# EasyEDA Pro project SW3526 快充.epro

# Schematic Schematic1
Create Date: 2023-02-26; Page Name: P1; Project Name: SW3526 快充; Schematic Name: Schematic1; Update Date: 2023-02-28; Company: 嘉立创EDA; Page Size: A4; Version: V1.0
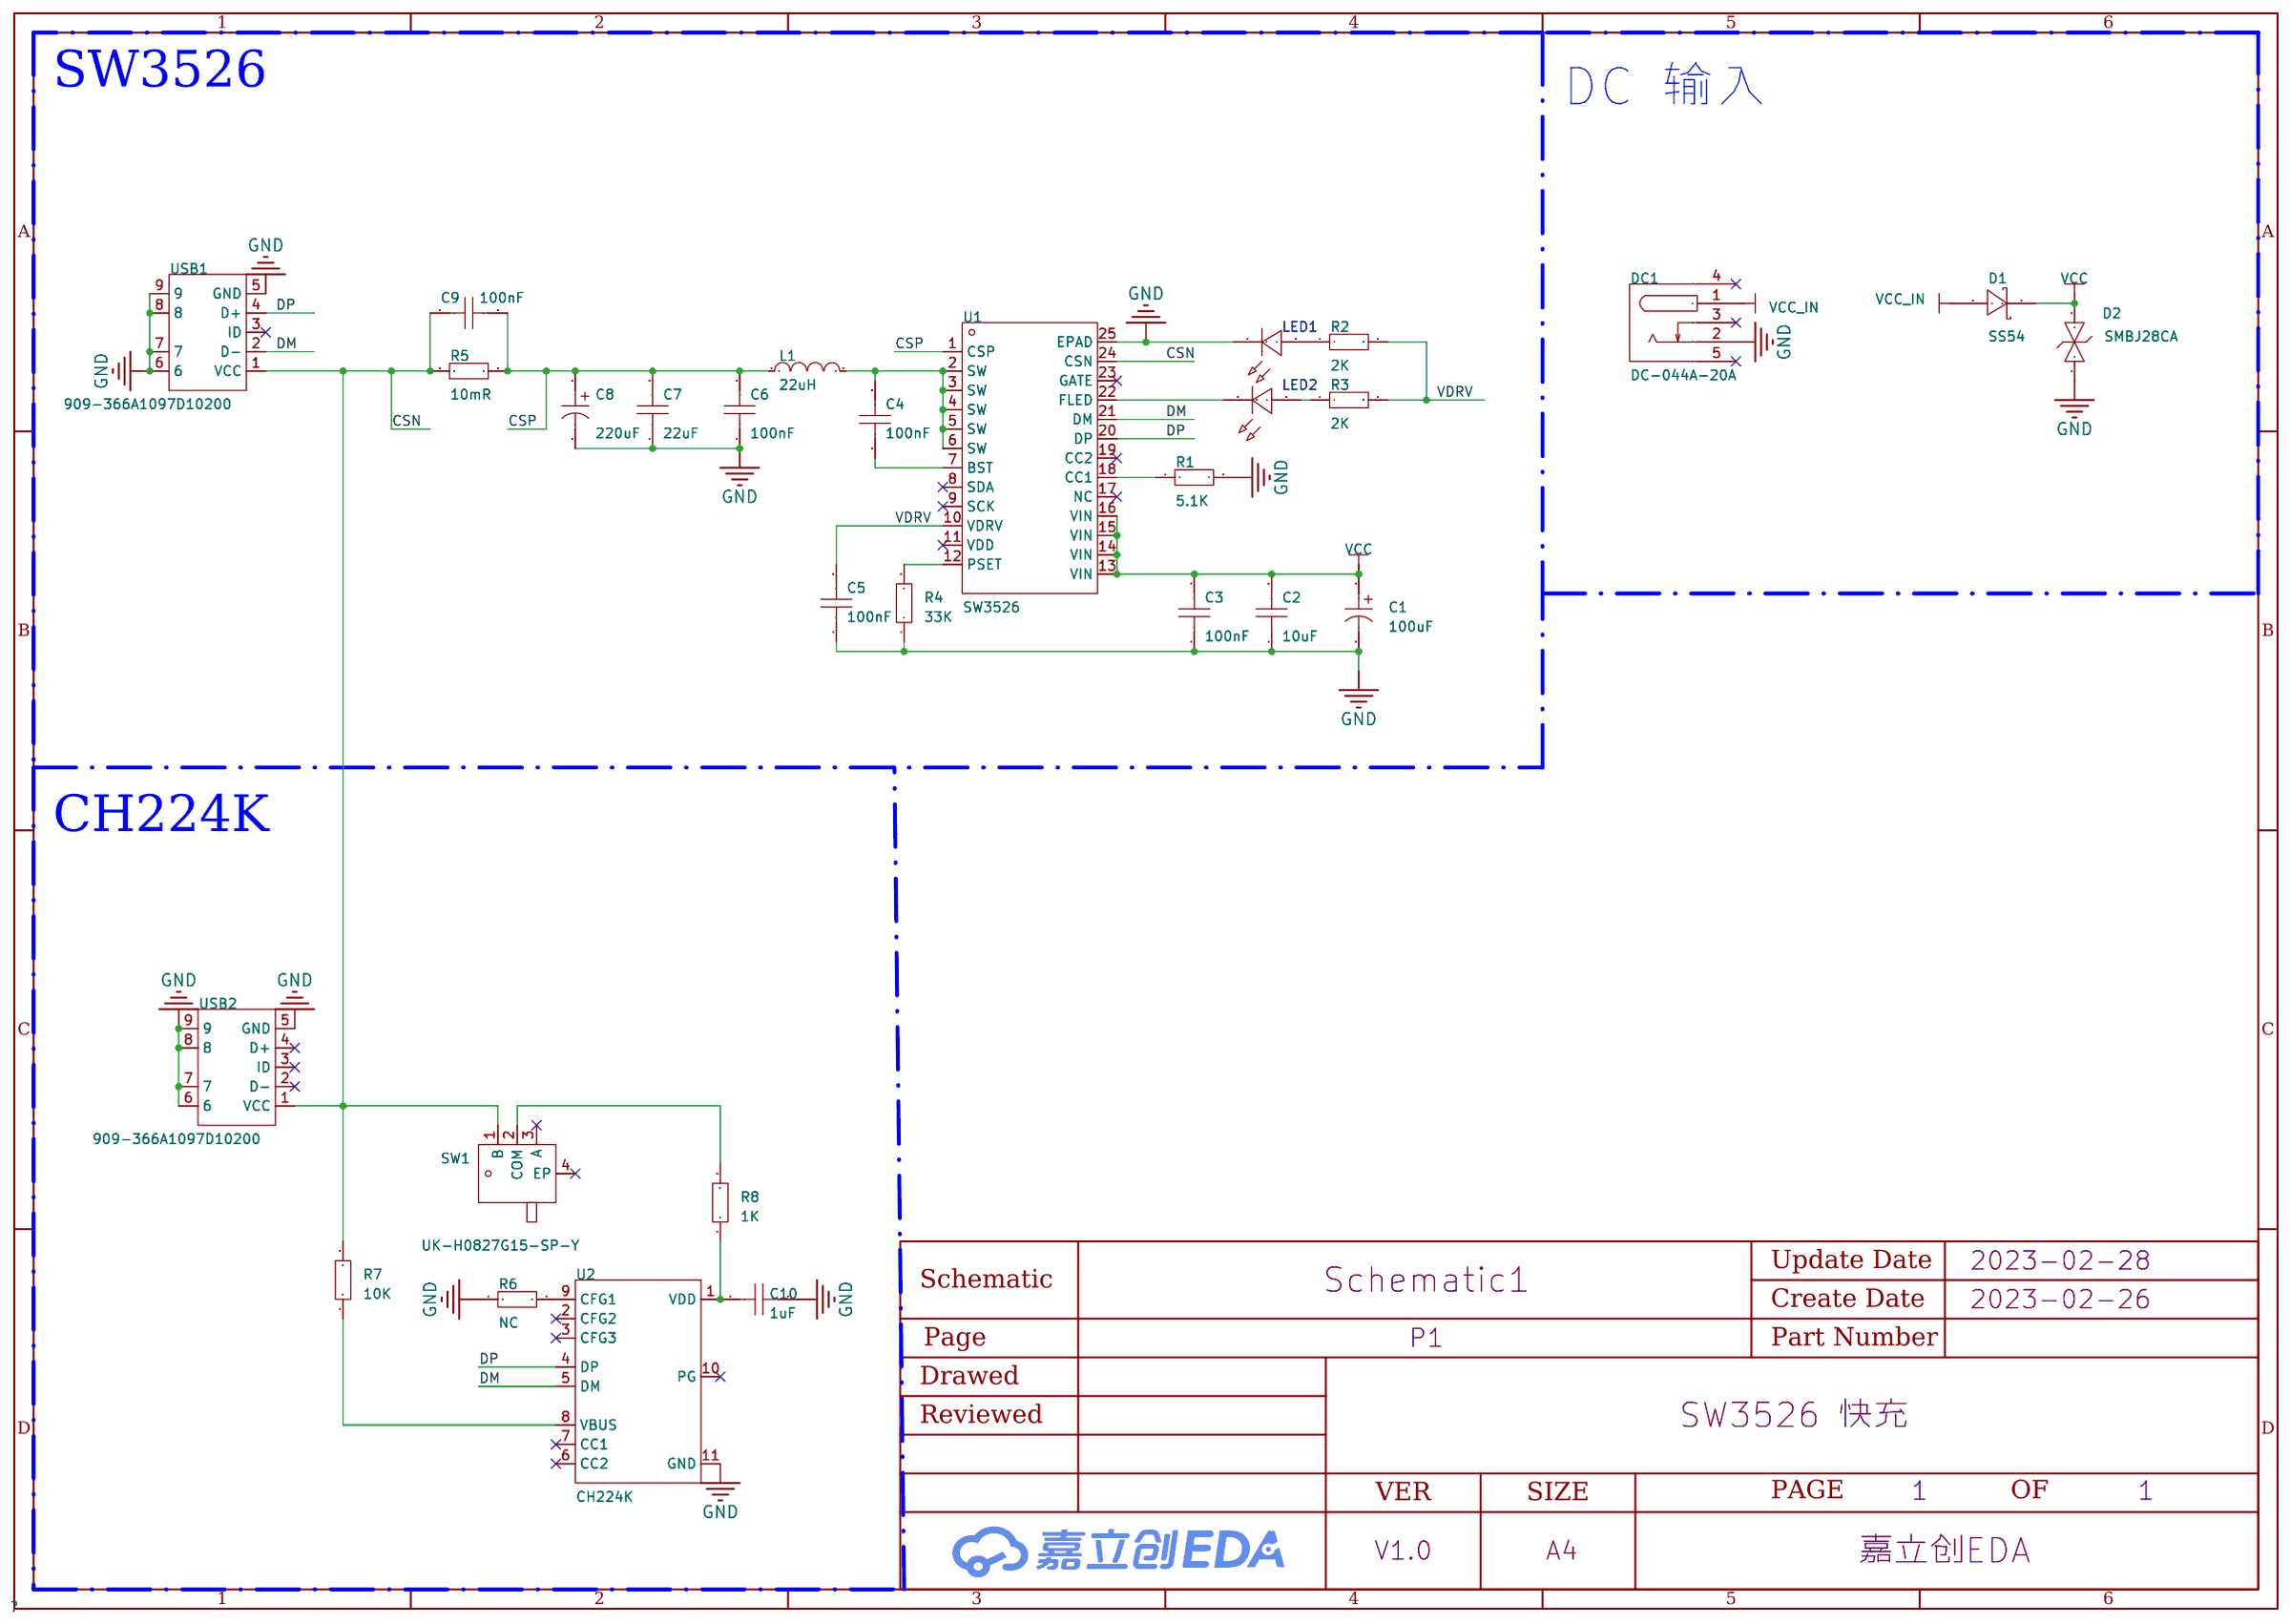
[diagram p0: schematic sheet]

## Parts
C1  100uF  [CAP-TH_BD6.3-P2.50-D0.5-FD]
C2  10uF  [C0603]
C3  100nF  [C0603]
C4  100nF  [C0603]
C5  100nF  [C0603]
C6  100nF  [C0603]
C7  22uF  [C0805]
C8  220uF  [CAP-TH_BD8.0-P3.50-D0.6-FD-2]
C9  100nF  [C0603]
C10  1uF  [C0603]
D1  SS54  [SMA_L4.2-W2.6-LS5.3-RD]
D2  SMBJ28CA  [SMB_L4.6-W3.6-LS5.3-BI]
DC1  DC-044A-20A  [DC-IN-TH_DC-044A-20A]
L1  22uH  [IND-SMD_L11.0-W10.0]
LED1  -  [LED_0805]
LED2  -  [LED_0805]
R1  5.1K  [R0603]
R2  2K  [R0603]
R3  2K  [R0603]
R4  33K  [R0603]
R5  10mR  [R1206]
R6  NC  [R0603]
R7  10K  [R0603]
R8  1K  [R0603]
SW1  UK-H0827G15-SP-Y  [SW-SMD_UK-H0827G15-SP-Y]
U1  SW3526  [QFN-24_L4.0-W4.0-P0.50-TL-EP2.5]
U2  CH224K  [ESSOP-10_L4.9-W3.9-P1.0-LS6.0-TL-EP]
USB1  909-366A1097D10200  [USB-A-TH_C168724]
USB2  909-366A1097D10200  [USB-A-TH_C168724]

## Library data of the parts
C1 = PCR1VPF101MF08LL25WP: 类型:聚合物;容值:100uF;精度:±20%;额定电压:35V;电容体直径:6.3mm;电容体长度:8mm;脚间距:-;纹波电流:-;等效串联电阻:-;工作寿命:-;工作温度:-55℃~+105℃;; LCSC Part Name: 100uF ±20% 35V; Supplier Part: C2918318; Manufacturer: Jianghai(南通江海); Supplier Footprint: 插件,6.3x8mm; JLCPCB Part Class: Extended Part; Datasheet: https://atta.szlcsc.com/upload/public/pdf/source/20211214/01C259705E8FEBCA7054E3760CF53B23.pdf; Supplier: LCSC; Type: 聚合物; Tolerance: ±20%; Rated Voltage: 35V; φD: 6.3mm; L: 8mm; Operating Temperature: -55℃~+105℃
C2-C6 C9 C10 = CAP_0603: Supplier Footprint: 0603
C7 = CAP_0805: Supplier Footprint: 0805
C8 = KNH2220UF35V149EC0049: 容值:220uF;精度:±20%;额定电压:35V;电容体直径:8mm;电容体长度:9mm;脚间距:3.5mm;纹波电流:1.7A@100kHz;等效串联电阻:40mΩ@100kHz;工作寿命:2000hrs@105℃;工作温度:-55℃~+105℃;; LCSC Part Name: 220uF ±20% 35V; Supplier Part: C2981462; Manufacturer: KNSCHA(科尼盛); Supplier Footprint: 径向引线,8x9mm; JLCPCB Part Class: Extended Part; Datasheet: https://atta.szlcsc.com/upload/public/pdf/source/20220426/9FC8A158D93B909CC105160B4A0CB698.pdf; Supplier: LCSC; Tolerance: ±20%; Rated Voltage: 35V; φD: 8mm; L: 9mm; Lead Spacing: 3.5mm; Ripple Current: 1.7A@100kHz; Equivalent Series Resistance(ESR): 40mΩ@100kHz; Lifetime @ Temp: 2000hrs@105℃; Operating Temperature: -55℃~+105℃
D1 = SS54: Supplier Part: C2929944; Manufacturer: CJ(江苏长电/长晶); Supplier Footprint: SMAG; Datasheet: https://atta.szlcsc.com/upload/public/pdf/source/20220614/5F851C6501CD456476EE6414B9DEDB2D.pdf; Supplier: LCSC
D2 = SMBJ28CA_C726872: 极性:双向;; LCSC Part Name: 双向; Supplier Part: C726872; Manufacturer: TWGMC(台湾迪嘉); Supplier Footprint: SMB; JLCPCB Part Class: 扩展库; Datasheet: https://atta.szlcsc.com/upload/public/pdf/source/20200901/C726811_07201DC3516E92FF13903A0BAE18F725.pdf; Supplier: LCSC; Polarity: 双向
DC1 = DC-044A-20A: 触点内径:2mm;触点外径:0.9mm;; LCSC Part Name: DC座 内铁芯2.0 11.6mm*10.1mm; Supplier Part: C129006; Manufacturer: 韩国韩荣; Supplier Footprint: Through Hole; JLCPCB Part Class: Extended Part; Datasheet: https://atta.szlcsc.com/upload/public/pdf/source/20210810/C8974B0AB7FDF70EB0A74D74746E6460.pdf; Supplier: LCSC; Inside Contact Diameter: 2mm; Outside Contact Diameter: 0.9mm
L1 = TMPC1004H-220MG-D: 额定电流:5A;直流电阻(DCR):64mΩ;精度:±20%;电感值:22uH;; LCSC Part Name: 22uH ±20%; Supplier Part: C357235; Manufacturer: TAI-TECH(台庆); Supplier Footprint: SMD; JLCPCB Part Class: Extended Part; Datasheet: https://atta.szlcsc.com/upload/public/pdf/source/20200917/C357235_4F4DF2089AC33CD332F52F0FB37977C7.pdf; Supplier: LCSC; Rated Current: 5A; Width: 10mm; DC Resistance (DCR): 64mΩ; Tolerance: ±20%; Height: 3.8mm; Length: 11mm
LED1 LED2 = LED_0805-G: Supplier Footprint: 0805
R1-R4 R6-R8 = Res_0603: Supplier Footprint: 0603
R5 = Res_1206: Supplier Footprint: 1206
SW1 = UK-H0827G15-SP-Y: 电路结构:-;开关功能:-;额定电压 DC:-;触点额定电流:-;额定电压 AC:-;; LCSC Part Name: 拨动开关6.6x2.6 7脚小拨动侧拨贴片; Supplier Part: C493292; Manufacturer: USAKRO(美韩); Supplier Footprint: SMD; JLCPCB Part Class: 扩展库; Datasheet: https://atta.szlcsc.com/upload/public/pdf/source/20200316/C493292_53A710CCBEF69A25529F79D71BD65D07.pdf; Supplier: LCSC
U1 = SW3526: Supplier Part: C2912236; Supplier Footprint: QFN24_L4.0-W4.0-P0.50-EP2.5; JLCPCB Part Class: Extended Part; Datasheet: 2021-10-26/429484A/09e553016b174cff95b128ce7bac8d5b/SW3526.pdf; Supplier: LCSC
U2 = CH224K: 应用功能:USB充电芯片;; Supplier Part: C970725; Manufacturer: WCH(南京沁恒); Supplier Footprint: ESSOP-10; JLCPCB Part Class: Extended Part; Datasheet: https://atta.szlcsc.com/upload/public/pdf/source/20220425/5F3B4646B9AC793D88468BCB08421765.pdf; Supplier: LCSC; Applications Function: USB充电芯片
USB1 USB2 = 909-366A1097D10200: 连接器类型:Type-A;标准:USB 2.0;公母:母座;触点数量:5;端口数量:1;; LCSC Part Name: Type-A 母座; Supplier Part: C168724; Manufacturer: 精拓金; Supplier Footprint: 插件; JLCPCB Part Class: Extended Part; Datasheet: https://atta.szlcsc.com/upload/public/pdf/source/20210308/C168724_98C76EC75DAB786678D80300AD64ABAF.pdf; Supplier: LCSC; Connector Type: Type-A; Standard: USB 2.0; Gender: 母座; Number of Contacts: 5; Number of Ports: 1

## Nets
GND: C1.2 C2.1 C3.1 C5.1 C6.1 C7.1 C8.2 C10.1 D2.1 DC1.2 LED1.1(C) R1.2 R4.1 R6.1 U1.25(EPAD) U2.11(GND) USB1.5(GND) USB1.6 USB1.7 USB1.8 USB1.9 USB2.5(GND) USB2.6 USB2.7 USB2.8 USB2.9
VCC: C1.1 C2.2 C3.2 D1.1(C) D2.2 U1.13(VIN) U1.14(VIN) U1.15(VIN) U1.16(VIN)
VCC_IN: D1.2(A) DC1.1
CSN: C9.1 R5.1 R7.2 SW1.1(B) U1.24(CSN) USB1.1(VCC) USB2.1(VCC)
CSP: C6.2 C7.2 C8.1 C9.2 L1.1 R5.2 U1.1(CSP)
DM: U1.21(DM) U2.5(DM) USB1.2(D-)
DP: U1.20(DP) U2.4(DP) USB1.4(D+)
VDRV: C5.2 R2.2 R3.2 U1.10(VDRV)
$1N483: R1.1 U1.18(CC1)
$1N591: LED2.1(C) U1.22(FLED)
$1N616: LED1.2(A) R2.1
$1N639: LED2.2(A) R3.1
$1N821: R4.2 U1.12(PSET)
$1N950: C4.2 L1.2 U1.2(SW) U1.3(SW) U1.4(SW) U1.5(SW) U1.6(SW)
$1N955: C4.1 U1.7(BST)
$1N1880: R6.2 U2.9(CFG1)
$1N1945: R7.1 U2.8(VBUS)
$1N2293: C10.2 R8.1 U2.1(VDD)
$1N2574: R8.2 SW1.2(COM)

Not connected (* = marked no-connect by the designer): DC1 3* 4* 5*; SW1 3(A)* 4(EP)*; U1 8(SDA)* 9(SCK)* 11(VDD)* 17(NC)* 19(CC2)* 23(GATE)*; U2 2(CFG2)* 3(CFG3)* 6(CC2)* 7(CC1)* 10(PG)*; USB1 3(ID)*; USB2 2(D-)* 3(ID)* 4(D+)*

## Notes on the sheet
- SW3526
- DC 输入
- CH224K

# Board PCB1
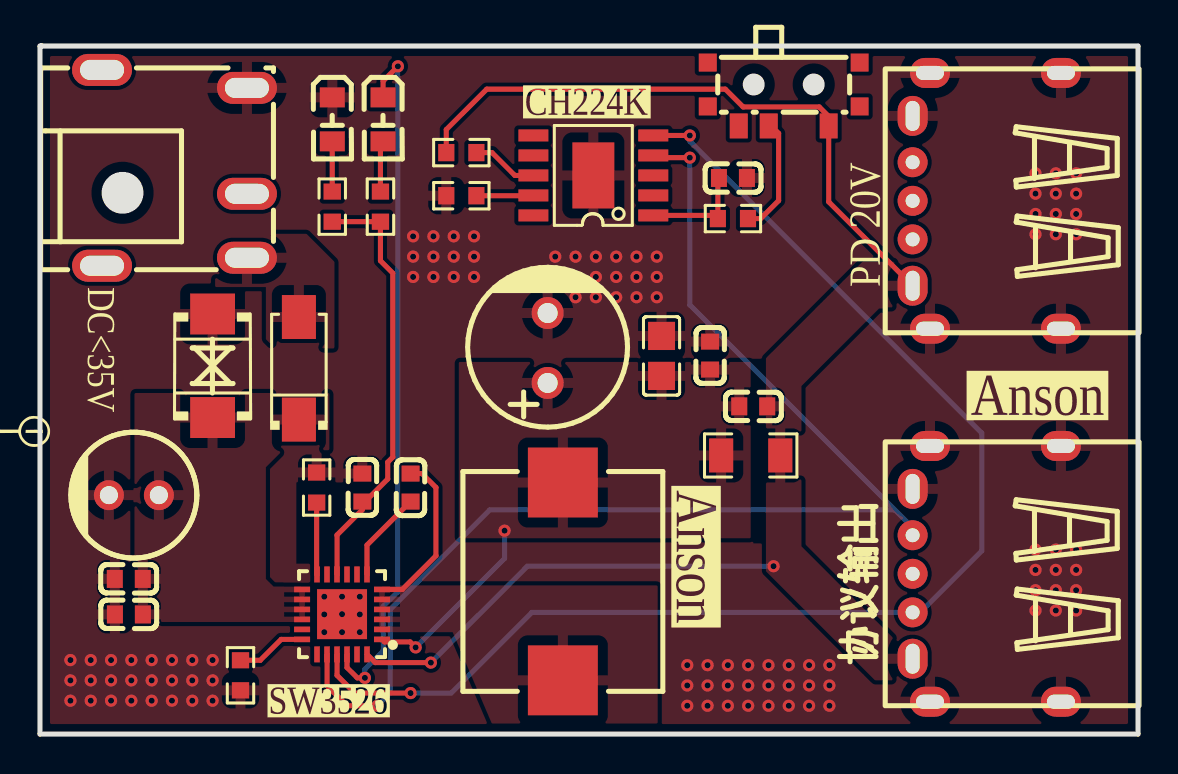
[diagram p1: board, top side]
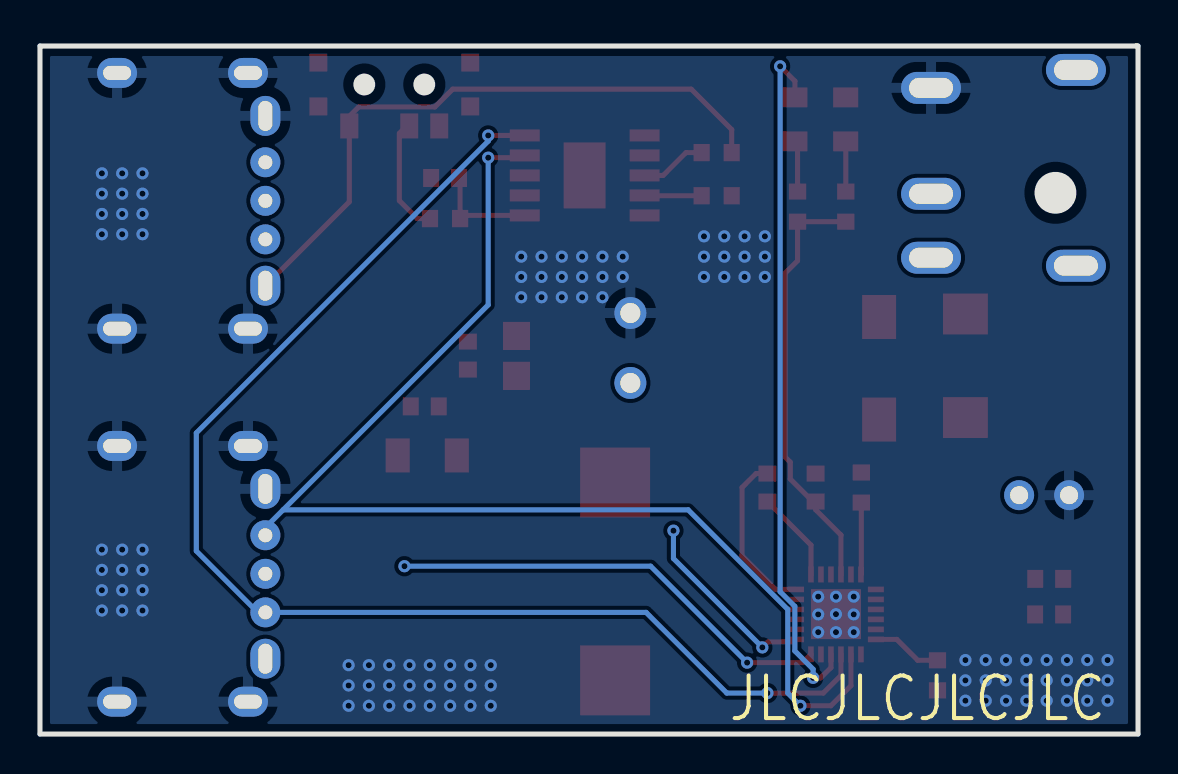
[diagram p2: board, bottom side, seen from below]

Outline 54.94 x 34.44 mm; copper layers: Top Layer, Bottom Layer. Coordinates in mm from the lower left corner of the outline.
Outline path: 0,34.44 54.94,34.44 54.94,0 0,0 0,34.44 ; 0.06,34.44 0.1,34.44 0.06,34.44
Stack: Top Layer 0.035mm / Dielectric1 1.51mm FR4 er 4.5 / Bottom Layer 0.035mm

## Design rules (mm)
template: 自定义配置
spacing copperThickness1oz (default): track to track 0.102, other pairs 0.152 to 0.3
spacing copperThickness2oz: track to track 0.203, other pairs 0.152 to 0.3
track width copperThickness1oz (default): min 0.127, default 0.254, max 2.54
track width copperThickness2oz: min 0.203, default 0.254, max 2.54
differential pair differentialPair (default): width min 0.127, default 0.254, max 2.54; gap min 0.152, default 0.152
via viaSize (default): diameter min 0.5, default 0.61, max 10; hole min 0.3, default 0.305, max 6.3
net CSP uses copperRegion1
net $1N950 uses copperRegion1
net CSN uses copperRegion1
net GND uses copperRegion1
net VCC uses copperRegion1
net VCC_IN uses copperRegion1

## Placement (name value [footprint] x y rotation side)
C1  100uF  [CAP-TH_BD6.3-P2.50-D0.5-FD]  4.7 11.96 180 top
C2  10uF  [C0603]  4.45 5.99 0 top
C3  100nF  [C0603]  4.45 7.77 0 top
C4  100nF  [C0603]  18.54 12.34 90 top
C5  100nF  [C0603]  16.13 12.34 270 top
C6  100nF  [C0603]  33.53 18.94 270 top
C7  22uF  [C0805]  31.1 18.93 270 top
C8  220uF  [CAP-TH_BD8.0-P3.50-D0.6-FD-2]  25.4 19.32 90 top
C9  100nF  [C0603]  35.69 16.4 180 top
C10  1uF  [C0603]  34.67 27.83 180 top
D1  SS54  [SMA_L4.2-W2.6-LS5.3-RD]  12.95 18.31 90 top
D2  SMBJ28CA  [SMB_L4.6-W3.6-LS5.3-BI]  8.64 18.43 270 top
DC1  DC-044A-20A  [DC-IN-TH_DC-044A-20A]  6.73 28.34 0 top
L1  22uH  [IND-SMD_L11.0-W10.0]  26.16 7.64 270 top
LED1  -  [LED_0805]  14.62 30.72 270 top
LED2  -  [LED_0805]  17.16 30.72 270 top
R1  5.1K  [R0603]  10.03 2.94 270 top
R2  2K  [R0603]  14.62 26.4 270 top
R3  2K  [R0603]  17.04 26.4 270 top
R4  33K  [R0603]  13.84 12.34 270 top
R5  10mR  [R1206]  35.56 13.94 180 top
R6  NC  [R0603]  21.08 26.94 0 top
R7  10K  [R0603]  21.08 29.1 180 top
R8  1K  [R0603]  34.67 25.8 0 top
SW1  UK-H0827G15-SP-Y  [SW-SMD_UK-H0827G15-SP-Y]  37.21 32.02 180 top
U1  SW3526  [QFN-24_L4.0-W4.0-P0.50-TL-EP2.5]  15.11 5.99 180 top
U2  CH224K  [ESSOP-10_L4.9-W3.9-P1.0-LS6.0-TL-EP]  27.69 27.96 90 top
USB1  909-366A1097D10200  [USB-A-TH_C168724]  47.37 8.02 90 top
USB2  909-366A1097D10200  [USB-A-TH_C168724]  47.37 26.69 90 top

## Footprints (pads in the part's own frame, mm; a bottom-side part is the same pattern mirrored in y, then rotated)
C0603
  rect 0.8x0.9 smd: 1(-0.7,0) 2(0.7,0)
C0805
  rect 1.41x1.35 smd: 1(-1,0) 2(1,0)
CAP-TH_BD6.3-P2.50-D0.5-FD
  round 1.5 hole 0.9: 1(-1.25,0) 2(1.25,0)
CAP-TH_BD8.0-P3.50-D0.6-FD-2
  round 1.6 hole 1: 1(-1.75,0) 2(1.75,0)
DC-IN-TH_DC-044A-20A
  oval 3x1.6 hole 2.2x1: 1(3.625,-4.5) 2(3.625,4.001) 3(3.625,-1.3) 4(-3.625,-4.9) 5(-3.625,4.9)
ESSOP-10_L4.9-W3.9-P1.0-LS6.0-TL-EP
  rect 0.6x1.5 smd: 1(-2,-3) 2(-1,-3) 3(0,-3) 4(1,-3) 5(2,-3) 6(2,3) 7(1,3) 8(0,3) 9(-1,3) 10(-2,3)
  rect 3.3x2.1 smd: 11(0,0)
IND-SMD_L11.0-W10.0
  rect 3.5x3.5 smd: 1(-4.95,0) 2(4.95,0)
LED_0805
  rect 1x1.25 smd: 1(-1.15,0.005) 2(1.05,0.005)
QFN-24_L4.0-W4.0-P0.50-TL-EP2.5
  rect 0.8x0.28 smd: 1(-2,1.25) 2(-2,0.75) 3(-2,0.25) 4(-2,-0.25) 5(-2,-0.75) 6(-2,-1.25) 13(2,-1.25) 14(2,-0.75) 15(2,-0.25) 16(2,0.25) 17(2,0.75) 18(2,1.25)
  rect 0.28x0.8 smd: 7(-1.25,-2) 8(-0.75,-2) 9(-0.25,-2) 10(0.25,-2) 11(0.75,-2) 12(1.25,-2) 19(1.25,2) 20(0.75,2) 21(0.25,2) 22(-0.25,2) 23(-0.75,2) 24(-1.25,2)
  rect 2.5x2.5 smd: 25(-0.001,-0.013)
R0603
  rect 0.806x0.864 smd: 1(-0.753,0) 2(0.753,0)
R1206
  rect 1.208x1.701 smd: 1(-1.479,0) 2(1.479,0)
SMA_L4.2-W2.6-LS5.3-RD
  rect 2.2x1.7 smd: 1(-2.566,0) 2(2.566,0)
SMB_L4.6-W3.6-LS5.3-BI
  rect 2.047x2.241 smd: 1(-2.591,0) 2(2.591,0)
SW-SMD_UK-H0827G15-SP-Y
  rect 0.899x1.25 smd: 1(-2.251,1.587) 2(0.75,1.587) 3(2.251,1.587)
  rect 0.899x0.899 smd: 4(-3.8,0.612) 4(-3.8,-1.587) 4(3.8,0.612) 4(3.8,-1.587)
USB-A-TH_C168724
  oval 2x1.5 hole 1.5x0.7: 1(-4.25,3.71) 5(4.25,3.71)
  round 1.5 hole 0.7: 2(-1.93,3.71) 3(0,3.71) 4(1.93,3.71)
  oval 1.5x2 hole 0.7x1.4: 6(-6.4,2.84) 7(-6.4,-3.71) 8(6.4,-3.71) 9(6.4,2.84)

## Nets
As in the schematic.

Pads without a net: DC1 3 4 5; SW1 3 4; U1 8 9 11 17 19 23; U2 2 3 6 7 10; USB1 3; USB2 2 3 4

## Via types
v1: diameter 0.61, hole 0.305, Top Layer to Bottom Layer, 120 vias

## Routing (per net, layer and track width the routed paths; a pad name or vN(x,y) marks a point on that pad's centre or on a via; arc(x,y) is an arc through that point)
GND: length 1
  Top Layer w0.254: v1(14.22,5.99) 14.22,4.98
  vias: v1(1.52,3.7) v1(1.52,2.69) v1(1.52,1.67) v1(2.54,3.7) v1(2.54,2.69) v1(2.54,1.67) v1(3.56,3.7) v1(3.56,2.69) v1(3.56,1.67) v1(4.57,3.7) v1(4.57,2.69) v1(4.57,1.67) v1(5.59,3.7) v1(5.59,2.69) v1(5.59,1.67) v1(6.6,3.7) v1(6.6,2.69) v1(6.6,1.67) v1(7.62,3.7) v1(7.62,2.69) v1(7.62,1.67) v1(8.64,3.7) v1(8.64,2.69) v1(8.64,1.67) v1(14.22,6.88) v1(14.22,5.1) v1(15.11,6.88) v1(15.11,6) v1(15.11,5.1) v1(16,6.88) v1(16,5.99) v1(16,5.1) v1(18.67,24.91) v1(18.67,23.89) v1(18.67,22.88) v1(19.69,24.91) v1(19.69,23.89) v1(19.69,22.88) v1(20.7,24.91) v1(20.7,23.89) v1(20.7,22.88) v1(21.72,24.91) v1(21.72,23.89) v1(21.72,22.88) v1(25.78,23.89) v1(25.78,22.88) v1(26.8,23.89) v1(26.8,22.88) v1(26.8,21.86) v1(27.81,23.89) v1(27.81,22.88) v1(27.81,21.86) v1(28.83,23.89) v1(28.83,22.88) v1(28.83,21.86) v1(29.85,23.89) v1(29.85,22.88) v1(29.85,21.86) v1(30.86,23.89) v1(30.86,22.88) v1(30.86,21.86) v1(32.39,3.45) v1(32.39,2.43) v1(32.39,1.42) v1(33.4,3.45) v1(33.4,2.43) v1(33.4,1.42) v1(34.42,3.45) v1(34.42,2.43) v1(34.42,1.42) v1(35.43,3.45) v1(35.43,2.43) v1(35.43,1.42) v1(36.45,3.45) v1(36.45,2.43) v1(36.45,1.42) v1(37.47,3.45) v1(37.47,2.43) v1(37.47,1.42) v1(38.48,3.45) v1(38.48,2.43) v1(38.48,1.42) v1(39.5,3.45) v1(39.5,2.43) v1(39.5,1.42) v1(49.81,28.06) v1(49.81,27.05) v1(49.81,26.03) v1(49.81,25.02) v1(49.81,9.23) v1(49.81,8.22) v1(49.81,7.2) v1(49.81,6.18) v1(50.83,28.06) v1(50.83,27.05) v1(50.83,26.03) v1(50.83,25.02) v1(50.83,9.23) v1(50.83,8.22) v1(50.83,7.2) v1(50.83,6.18) v1(51.84,28.06) v1(51.84,27.05) v1(51.84,26.03) v1(51.84,25.02) v1(51.84,9.23) v1(51.84,8.22) v1(51.84,7.2) v1(51.84,6.18)
CSN: length 54.4
  Top Layer w0.254: R7.2 20.33,30.25 22.35,32.28 34.29,32.28 35.18,31.39 38.99,31.39 39.46,30.92 39.46,26.64 USB2.1 ; U1.24 16.78,3.57 v1(19.56,3.57)
  Bottom Layer w0.254: v1(36.7,8.4) 24.38,8.4 v1(19.56,3.57)
CSP: length 9.5
  Top Layer w0.254: U1.1 17.24,4.61 18.52,4.61 v1(18.8,4.34)
  Bottom Layer w0.254: v1(23.24,10.18) 23.24,8.78 v1(18.8,4.34)
DM: length 65.3
  Top Layer w0.254: U1.21 14.86,2.94 15.75,2.05 v1(18.54,2.05) ; U2.5 v1(32.51,29.96)
  Bottom Layer w0.254: v1(32.51,29.96) 32.51,29.67 47.12,15.07 47.12,9.16 44.04,6.09 24.61,6.09 20.57,2.05 v1(18.54,2.05)
DP: length 62.5
  Top Layer w0.254: U1.20 14.36,2.42 15.37,1.42 v1(16.89,1.42) ; U2.4 30.8,28.85 v1(32.51,28.85)
  Bottom Layer w0.254: 42.77,11.22 22.5,11.22 17.53,6.24 17.53,2.05 v1(16.89,1.42) ; 42.77,11.22 32.51,21.48 v1(32.51,28.85) ; 42.77,11.22 44.04,9.95
VDRV: length 21.6
  Top Layer w0.254: R2.2 R3.2 17.04,23.69 17.65,23.07 17.65,13.86 17.4,13.61 17.4,12.76 16.13,11.49 ; U1.10 14.86,9.96 16.13,11.23 16.13,11.49 ; C5.2 16.13,11.49
$1N483: length 3.5
  Top Layer w0.254: U1.18 12.07,4.74 11.02,3.69 R1.1
$1N591: length 34.9
  Top Layer w0.254: v1(17.91,33.42) 17.17,32.68 LED2.1 ; v1(16.26,2.81) 15.88,2.81 15.36,3.32 U1.22
  Bottom Layer w0.254: v1(17.91,33.42) 17.91,7.13 17.17,6.39 17.17,4.16 16.26,3.24 v1(16.26,2.81)
$1N616: length 2.5
  Top Layer w0.254: R2.1 14.62,29.67
$1N639: length 2.5
  Top Layer w0.254: R3.1 17.04,29.67
$1N821: length 3.6
  Top Layer w0.254: R4.2 13.84,7.99
$1N950: length 8.4
  Top Layer w0.254: U1.6 18.13,7.24 19.81,8.92 19.81,12.34 19.11,13.04 C4.2
$1N955: length 4.6
  Top Layer w0.254: U1.7 16.36,9.46 C4.1
$1N1880: length 2.9
  Top Layer w0.254: R6.2 24.69,26.94
$1N1945: length 3.3
  Top Layer w0.254: R7.1 22.62,29.1 23.76,27.96 U2.8
$1N2293: length 5.3
  Top Layer w0.254: C10.2 33.92,27.78 33.92,25.96 ; 33.92,25.96 U2.1 ; 33.92,25.96 R8.1
$1N2574: length 6
  Top Layer w0.254: R8.2 36.06,25.8 36.96,26.7 36.96,30.07 36.46,30.56

## Copper pours and planes (outline as drawn; the poured copper is in the pictures)
GND on Top Layer: 0,34.43 54.94,34.43 54.94,0 0,0
GND on Bottom Layer: 0.06,34.43 54.94,34.43 54.94,0 0.06,0
VCC on Top Layer: 4.73,17.07 14.48,17.07 14.48,14.21 12.16,14.21 11.3,13.35 11.3,7.77 11.68,7.38 13.59,7.38 13.59,5.61 4.73,5.61
VCC_IN on Top Layer: 8.76,25.04 8.76,22.37 11.3,22.37 11.3,19.76 11.77,19.3 14.73,19.3 14.73,23.64 13.33,25.04
CSN on Top Layer: 36.32,14.88 38.1,14.88 38.1,9.39 42.67,4.82 44.58,4.82 44.58,2.69 41.78,2.69 36.32,8.15
CSN on Top Layer: 36.32,12.85 38.1,12.85 38.1,17.42 41.98,21.3 42.29,21.3 42.35,21.35 44.58,21.35 44.58,23.64 41.15,23.64 36.32,18.81
CSP on Top Layer: 20.95,9.8 35.56,9.8 35.56,18.63 20.95,18.63
$1N950 on Top Layer: 16.71,7.44 30.91,7.44 30.91,0.53 22.61,0.53 20.65,5.1 16.71,5.1

## Text on the board
Bottom Silkscreen Layer: JLCJLCJLCJLC
Top Silkscreen Layer: SW3526 | CH224K | DC<35V | PD 20V | Anson | 协议输出
